# Altium project Telemetry.PrjPcb
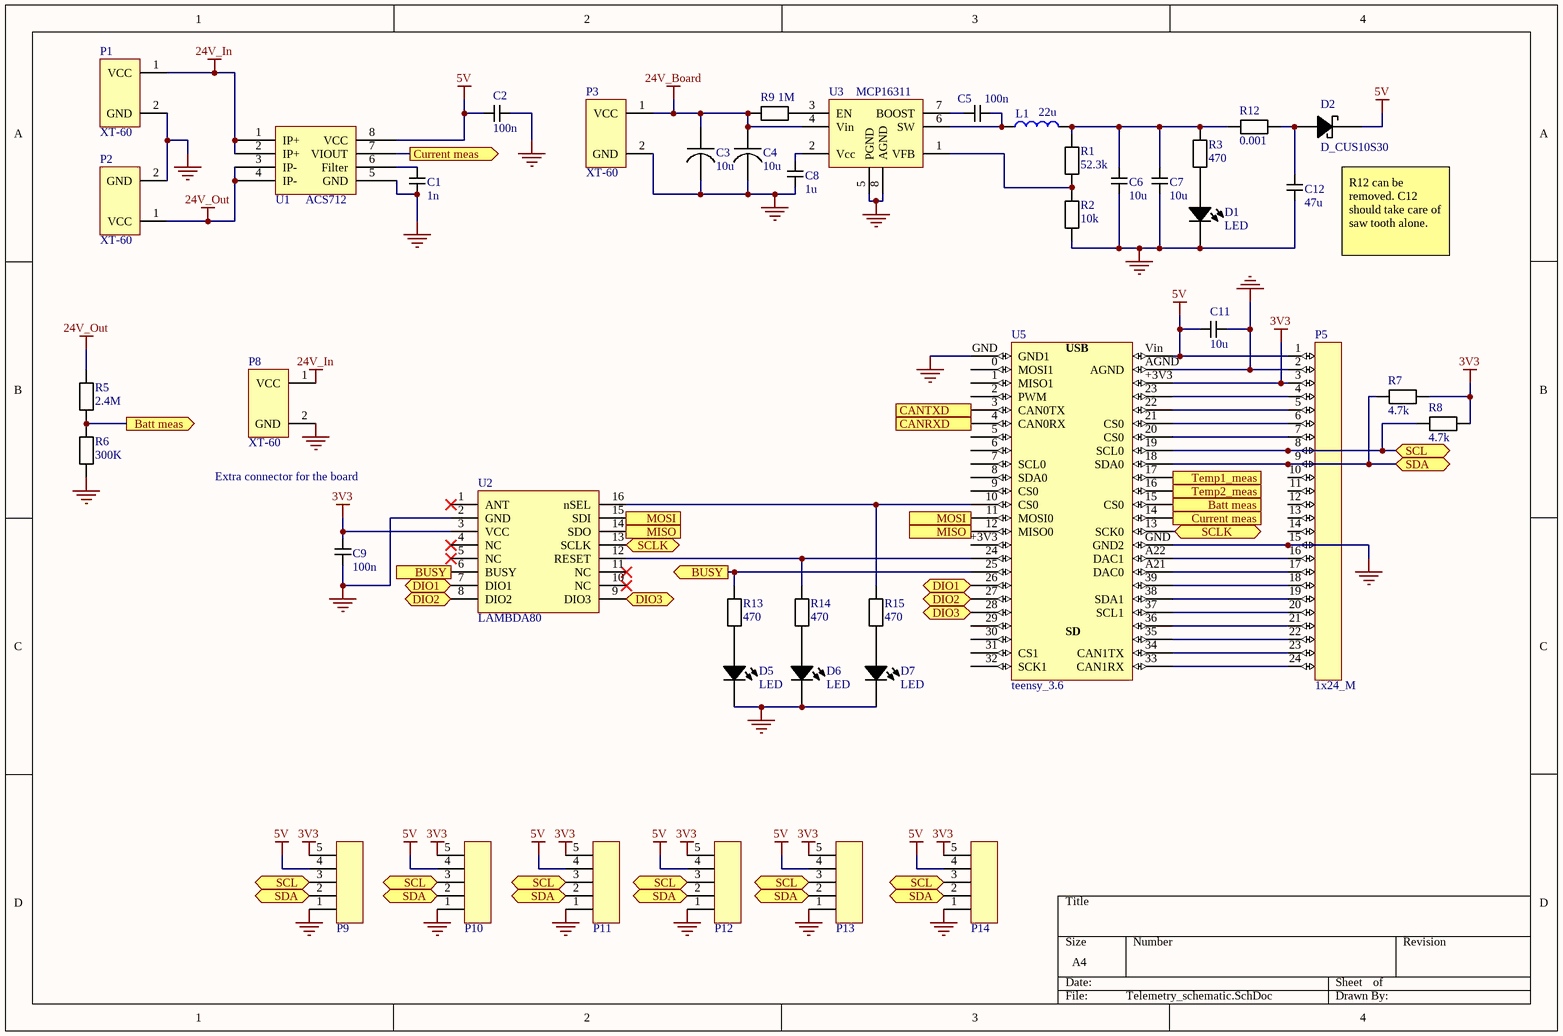
[diagram p0: Telemetry_schematic.SchDoc]
3 sheets, 71 parts. Net scope: flat (ports and power ports of the same name join across sheets).
Board file: Telemetry_PCB.PcbDoc
Sheets:
  Telemetry_schematic.SchDoc
  Telemetry_canbus.SchDoc
  Telemetry_temp_meas.SchDoc

## Sheet Telemetry_schematic.SchDoc: oiaejrboidr
size A4; Revision: 1.1; SheetNumber: 1; SheetTotal: 1

### Parts
C1  value 1n  [C_SMD_0805_pcb]  (hidden comment: SMD)
C2  value 100n  [C_SMD_0805_pcb]  (hidden comment: SMD)
C3  value 10u  [C_EL_SMT_Ø6.3]  (hidden comment: C_EL_SMT_Ø6.3)
C4  value 10u  [C_EL_SMT_Ø6.3]  (hidden comment: C_EL_SMT_Ø6.3)
C5  value 100n  [C_SMD_0805_pcb]  (hidden comment: SMD)
C6  value 10u  [C_SMD_0805_pcb]  (hidden comment: SMD)
C7  value 10u  [C_SMD_0805_pcb]  (hidden comment: SMD)
C8  value 1u  [C_SMD_0805_pcb]  (hidden comment: SMD)
C9  value 100n  [C_SMD_0805_pcb]  (hidden comment: SMD)
C11  value 10u  [C_SMD_0805_pcb]  (hidden comment: SMD)
C12  value 47u  [C_SMD_0805_pcb]  (hidden comment: SMD)
D1  LED  [D_LED_0805]
D2  D_CUS10S30  [D_SC-76]
D5  LED  [D_LED_0805]
D6  LED  [D_LED_0805]
D7  LED  [D_LED_0805]
L1  value 22u  [L_DR73_SMD]  (hidden comment: SMD)
P1  XT-60  [XT-60]
P2  XT-60  [XT-60]
P3  XT-60  [XT-60]
P5  1x24_M  [PIN_HEADER_M_1x24]
P8  XT-60  [XT-60]
P9  1x5_M  [PIN_HEADER_M_1x5]  (value not drawn)
P10  1x5_M  [PIN_HEADER_M_1x5]  (value not drawn)
P11  1x5_M  [PIN_HEADER_M_1x5]  (value not drawn)
P12  1x5_M  [PIN_HEADER_M_1x5]  (value not drawn)
P13  1x5_M  [PIN_HEADER_M_1x5]  (value not drawn)
P14  1x5_M  [PIN_HEADER_M_1x5]  (value not drawn)
R1  value 52.3k  [R_SMD_0805_pcb]  (hidden comment: SMD)
R2  value 10k  [R_SMD_0805_pcb]  (hidden comment: SMD)
R3  value 470  [R_SMD_0805_pcb]  (hidden comment: SMD)
R5  value 2.4M  [R_SMD_0805_pcb]  (hidden comment: SMD)
R6  value 300K  [R_SMD_0805_pcb]  (hidden comment: SMD)
R7  value 4.7k  [R_SMD_0805_pcb]  (hidden comment: SMD)
R8  value 4.7k  [R_SMD_0805_pcb]  (hidden comment: SMD)
R9  value 1M  [R_SMD_0805_pcb]  (hidden comment: SMD)
R12  value 0.001  [R_SMD_0805_pcb]  (hidden comment: SMD)
R13  value 470  [R_SMD_0805_pcb]  (hidden comment: SMD)
R14  value 470  [R_SMD_0805_pcb]  (hidden comment: SMD)
R15  value 470  [R_SMD_0805_pcb]  (hidden comment: SMD)
U1  ACS712  [ACS712_SMD]
U2  LAMBDA80  [LAMBDA62_SMT]
U3  MCP16311  [MCP16311/2_MSOP]
U5  teensy_3.6  [teensy_3.6]

### Ports
Batt meas (in), Batt meas (out), BUSY (in), BUSY (out), CANRXD (out), CANTXD (in), Current meas (in), Current meas (out), DIO1 (bidir), DIO2 (bidir), DIO3 (bidir), MISO (in), MISO (out), MOSI (in), MOSI (out), SCL (bidir), SCLK (bidir), SDA (bidir), Temp1_meas (in), Temp2_meas (in)

### Nets
3V3: C9.1 P5.3 P9.5 P10.5 P11.5 P12.5 P13.5 P14.5 R7.1 R8.1 U2.3(VCC) U5.+3V3
5V: C2.1 C11.2 D2.2 P5.1 P9.4 P10.4 P11.4 P12.4 P13.4 P14.4 U1.8(VCC) U5.Vin
24V_Board: C3.2 C4.2 P3.1(VCC) R9.1 U3.4(Vin)
24V_In: P1.1(VCC) P8.1(VCC) U1.1(IP+) U1.2(IP+)
24V_Out: P2.1(VCC) R5.2 U1.3(IP-) U1.4(IP-)
GND: C1.2 C2.2 C3.1 C4.1 C6.2 C7.2 C8.2 C9.2 C11.1 C12.2 D1.2 D5.2 D6.2 D7.2 P1.2(GND) P2.2(GND) P3.2(GND) P5.2 P5.15 P8.2(GND) P9.1 P10.1 P11.1 P12.1 P13.1 P14.1 R2.1 R6.1 U1.5(GND) U2.2(GND) U3.5(PGND) U3.8(AGND) U5.AGND U5.GND(GND1)
NetC1_1: C1.1 U1.6(Filter)
NetC5_1: C5.1 U3.7(BOOST)
NetC5_2: C5.2 L1.2 U3.6(SW)
NetC6_1: C6.1 C7.1 L1.1 R1.2 R3.2 R12.1
NetC8_1: C8.1 U3.2(Vcc)
NetC12_1: C12.1 D2.1 R12.2
NetC15_1: U5.17 ; port Temp1_meas
NetC18_1: U5.16 ; port Temp2_meas
NetD1_1: D1.1 R3.1
NetD5_1: D5.1 R13.1
NetD6_1: D6.1 R14.1
NetD7_1: D7.1 R15.1
NetP5_4: P5.4 U5.23
NetP5_5: P5.5 U5.22
NetP5_6: P5.6 U5.21(CS0)
NetP5_7: P5.7 U5.20(CS0)
NetP5_8: P5.8 P9.3 P10.3 P11.3 P12.3 P13.3 P14.3 R8.2 U5.19(SCL0) ; port SCL
NetP5_9: P5.9 P9.2 P10.2 P11.2 P12.2 P13.2 P14.2 R7.2 U5.18(SDA0) ; port SDA
NetP5_16: P5.16 U5.A22(DAC1)
NetP5_17: P5.17 U5.A21(DAC0)
NetP5_18: P5.18 U5.39
NetP5_19: P5.19 U5.38(SDA1)
NetP5_20: P5.20 U5.37(SCL1)
NetP5_21: P5.21 U5.36
NetP5_22: P5.22 U5.35
NetP5_23: P5.23 U5.34(CAN1TX)
NetP5_24: P5.24 U5.33(CAN1RX)
NetR1_1: R1.1 R2.2 U3.1(VFB)
NetR5_1: R5.1 R6.2 U5.15(CS0) ; port Batt meas
NetR9_2: R9.2 U3.3(EN)
NetR10_1: U5.4(CAN0RX) ; port CANRXD
NetR11_1: U5.3(CAN0TX) ; port CANTXD
NetR13_2: R13.2 U2.6(BUSY) U5.25 ; port BUSY
NetR14_2: R14.2 U2.12(RESET) U5.24
NetR15_2: R15.2 U2.16(nSEL) U5.10(CS0)
NetU1_7: U1.7(VIOUT) U5.14 ; port Current meas
NetU2_7: U2.7(DIO1) U5.26 ; port DIO1
NetU2_8: U2.8(DIO2) U5.27 ; port DIO2
NetU2_9: U2.9(DIO3) U5.28 ; port DIO3
NetU2_13: U2.13(SCLK) U5.13(SCK0) ; port SCLK
NetU2_14: U2.14(SDO) U5.12(MISO0) ; port MISO
NetU2_15: U2.15(SDI) U5.11(MOSI0) ; port MOSI

Not connected (* = marked no-connect by the designer): P5 10 11 12 13 14; U2 1(ANT)* 4(NC)* 5(NC)* 10(NC)* 11(NC)*; U5 0(MOSI1) 1(MISO1) 2(PWM) 5 6 7(SCL0) 8(SDA0) 9(CS0) 29 30 31(CS1) 32(SCK1)

### Notes on the sheet
- R12 can be removed. C12 should take care of saw tooth alone.
- Extra connector for the board
- (in symbol teensy_3.6) USB; SD

### Library data of the parts
C1 C2 C5-C9 C11 C12 = C_SMD_0805: Supplier 1: *; Supplier Part Number 1: *
D1 D5-D7 = D_LED_0805_SMD
D2 = D_CUS10S30: Schottky diode, 30V reverse voltage. 220mV forward drop @1A; Supplier Part Number 1: CUS10S30H3FCT-ND; Supplier Link 1: https://www.digikey.no/product-detail/en/toshiba-semiconductor-and-storage/CUS10S30H3F/CUS10S30H3FCT-ND/5114377
L1 = L_DR73_SMD: Supplier 1: *; Supplier Part Number 1: *
P5 = PIN_HEADER_M_1x24: Supplier Part Number 1: *; Supplier 1: *
P9-P14 = PIN_HEADER_M_1x5: Supplier Part Number 1: *; Supplier 1: *
R1-R3 R5-R9 R12-R15 = R_SMD_0805: Supplier 1: *; Supplier Part Number 1: *
U1 = ACS712_SMD: Supplier 1: *; Supplier Part Number 1: *
U2 = LAMBDA_80_DIP
U3 = MCP16311/2_SMD: Supplier 1: *; Supplier Part Number 1: *
C3 C4 = C_EL_SMT_Ø6.3: Supplier 1: *; Supplier Part Number 1: *
P1-P3 P8 = XT-60: Supplier Part Number 1: *; Supplier 1: *
U5 = teensy_3.6: Supplier 1: *; Supplier Part Number 1: *

## Sheet Telemetry_canbus.SchDoc: Telemetry CANbus
size A4; Organization: Altium Limited; Address1: L3, 12a Rodborough Rd; Address2: Frenchs Forest; Address3: NSW; Address4: Australia 2086; SheetNumber: 2; SheetTotal: 2
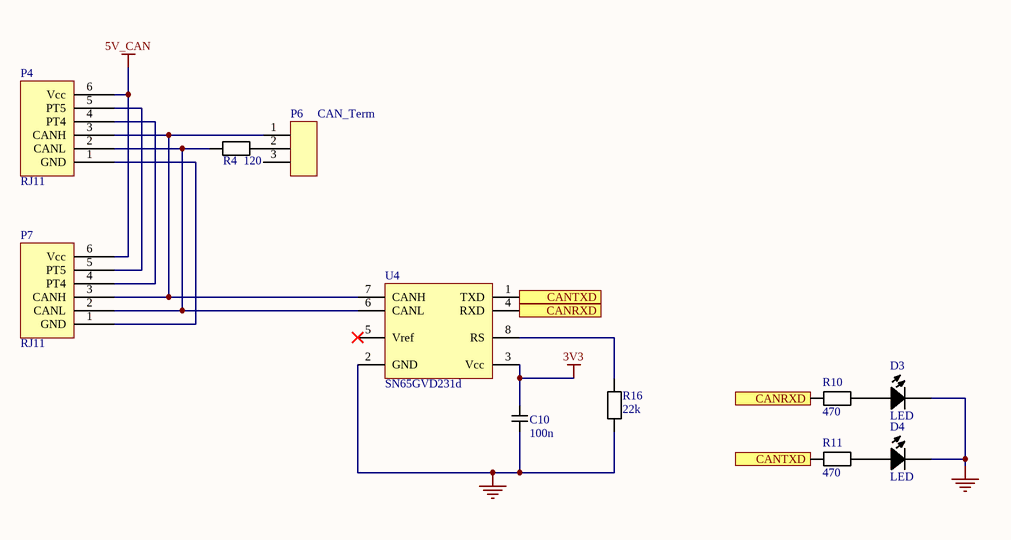
[diagram p1: Telemetry_canbus.SchDoc]

### Parts
C10  value 100n  [C_SMD_0805_pcb]  (hidden comment: SMD)
D3  LED  [D_LED_0805]
D4  LED  [D_LED_0805]
P4  RJ11  [RJ11_Connector]
P6  CAN_Term  [PIN_HEADER_M_1x3]
P7  RJ11  [RJ11_Connector]
R4  value 120  [R_SMD_0805_pcb]  (hidden comment: SMD)
R10  value 470  [R_SMD_0805_pcb]  (hidden comment: SMD)
R11  value 470  [R_SMD_0805_pcb]  (hidden comment: SMD)
R16  value 22k  [R_SMD_0805_pcb]  (hidden comment: SMD)
U4  SN65GVD231d  [SN65HVD231D_SMD]

### Ports
CANRXD, CANRXD (in), CANTXD, CANTXD (out)

### Nets
3V3: C10.1 U4.3(Vcc)
5V_CAN: P4.6(Vcc) P7.6(Vcc)
GND: C10.2 D3.2 D4.2 R16.1 U4.2(GND)
NetD3_1: D3.1 R10.2
NetD4_1: D4.1 R11.2
NetP4_1: P4.1(GND) P7.1(GND)
NetP4_2: P4.2(CANL) P7.2(CANL) R4.1 U4.6(CANL)
NetP4_3: P4.3(CANH) P6.1 P7.3(CANH) U4.7(CANH)
NetP4_4: P4.4(PT4) P7.4(PT4)
NetP4_5: P4.5(PT5) P7.5(PT5)
NetP6_2: P6.2 R4.2
NetR10_1: R10.1 U4.4(RXD) ; port CANRXD
NetR11_1: R11.1 U4.1(TXD) ; port CANTXD
NetR16_2: R16.2 U4.8(RS)

Not connected (* = marked no-connect by the designer): P6 3; U4 5(Vref)*

### Notes on the sheet
- Title
- Size:
- Date:
- A4
- Number:
- Time:
- Revision:
- Sheet
- of
- File:

### Library data of the parts
C10 = C_SMD_0805: Supplier 1: *; Supplier Part Number 1: *
D3 D4 = D_LED_0805_SMD
P4 P7 = RJ11_Connector: Supplier Part Number 1: *; Supplier 1: *
P6 = PIN_HEADER_M_1x3
R4 R10 R11 R16 = R_SMD_0805: Supplier 1: *; Supplier Part Number 1: *
U4 = SN65HVD231D_SMD: Supplier 1: *; Supplier Part Number 1: *

## Sheet Telemetry_temp_meas.SchDoc: Telemetry temp meas
size A4; Author: Magnus S. Aarnes; DrawnBy: Magnus Aarnes; Organization: Altium Limited; DocumentNumber: 1; Revision: 1; SheetNumber: 2; SheetTotal: 3
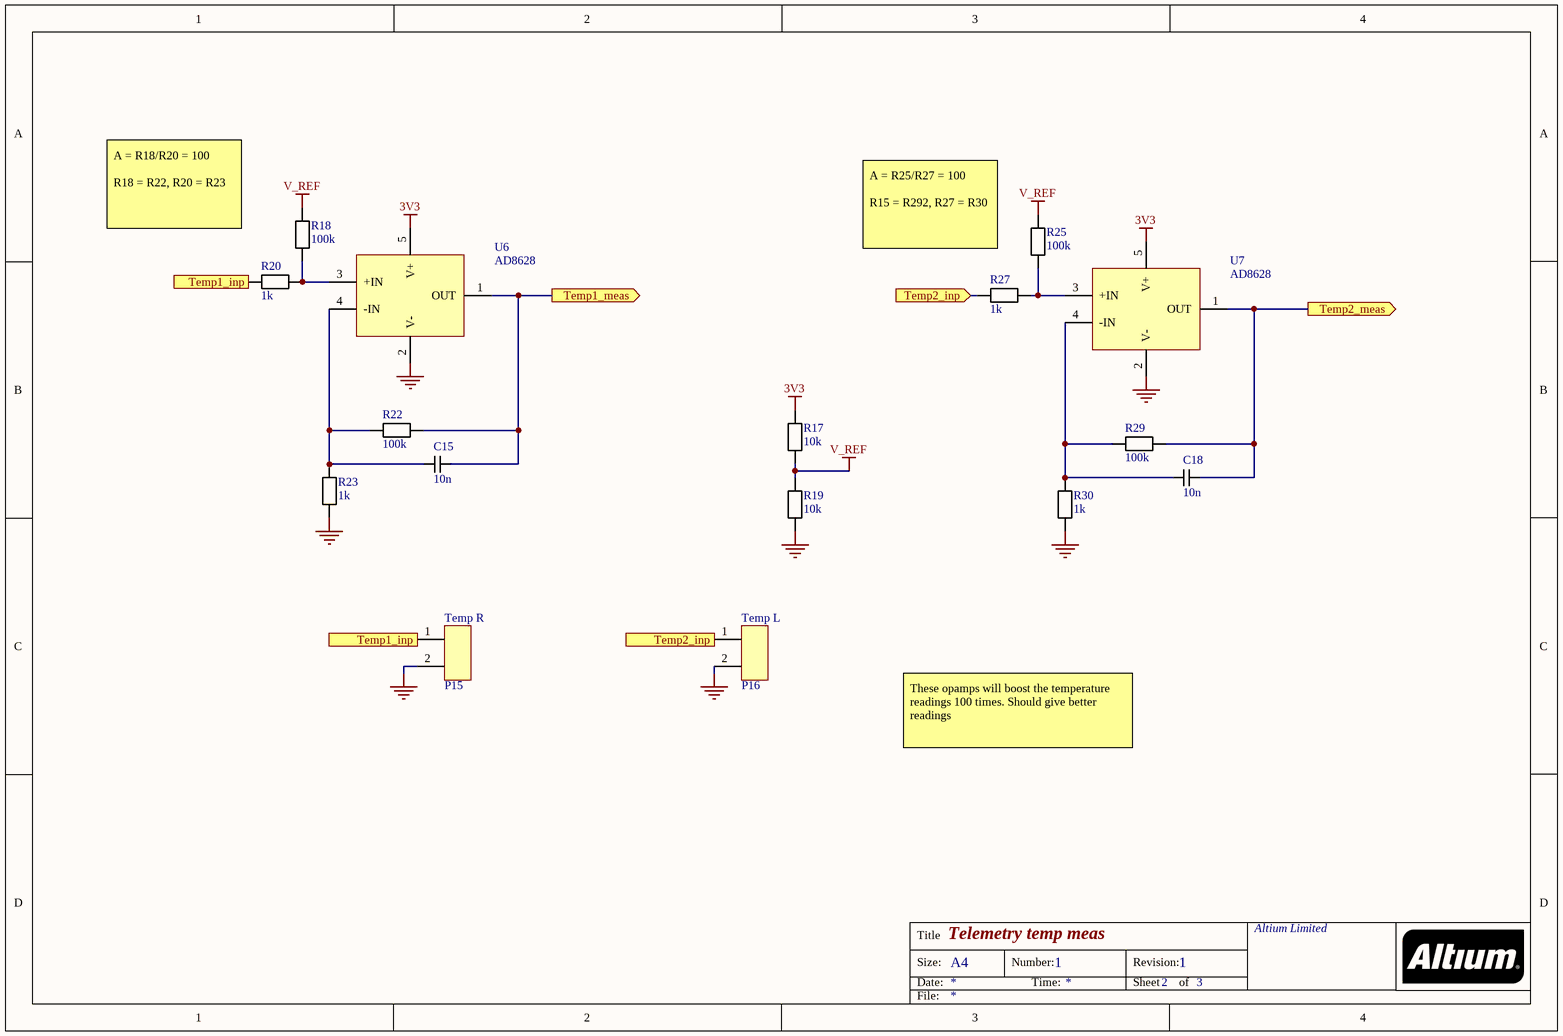
[diagram p2: Telemetry_temp_meas.SchDoc]

### Parts
C15  value 10n  [C_SMD_0805_pcb]  (hidden comment: SMD)
C18  value 10n  [C_SMD_0805_pcb]  (hidden comment: SMD)
P15  Temp R  [JST_SE_2PIN]
P16  Temp L  [JST_SE_2PIN]
R17  value 10k  [R_SMD_0805_pcb]  (hidden comment: SMD)
R18  value 100k  [R_SMD_0805_pcb]  (hidden comment: SMD)
R19  value 10k  [R_SMD_0805_pcb]  (hidden comment: SMD)
R20  value 1k  [R_SMD_0805_pcb]  (hidden comment: SMD)
R22  value 100k  [R_SMD_0805_pcb]  (hidden comment: SMD)
R23  value 1k  [R_SMD_0805_pcb]  (hidden comment: SMD)
R25  value 100k  [R_SMD_0805_pcb]  (hidden comment: SMD)
R27  value 1k  [R_SMD_0805_pcb]  (hidden comment: SMD)
R29  value 100k  [R_SMD_0805_pcb]  (hidden comment: SMD)
R30  value 1k  [R_SMD_0805_pcb]  (hidden comment: SMD)
U6  AD8628  [SOT-23-5]
U7  AD8628  [SOT-23-5]

### Ports
Temp1_inp (in), Temp1_inp (out), Temp1_meas (out), Temp2_inp (in), Temp2_inp (out), Temp2_meas (out)

### Nets
3V3: R17.2 U6.5(V+) U7.5(V+)
GND: P15.2 P16.2 R19.1 R23.1 R30.2 U6.2(V-) U7.2(V-)
V_REF: R17.1 R18.2 R19.2 R25.2
NetC15_1: C15.1 R22.2 U6.1(OUT) ; port Temp1_meas
NetC15_2: C15.2 R22.1 R23.2 U6.4(-IN)
NetC18_1: C18.1 R29.2 U7.1(OUT) ; port Temp2_meas
NetC18_2: C18.2 R29.1 R30.1 U7.4(-IN)
NetP15_1: P15.1 R20.1 ; port Temp1_inp
NetP16_1: P16.1 R27.1 ; port Temp2_inp
NetR18_1: R18.1 R20.2 U6.3(+IN)
NetR25_1: R25.1 R27.2 U7.3(+IN)

### Notes on the sheet
- A = R18/R20 = 100
  R18 = R22, R20 = R23
- A = R25/R27 = 100
  R15 = R292, R27 = R30
- These opamps will boost the temperature readings 100 times. Should give better readings
- Title
- Size:
- Date:
- A4
- Number:
- Time:
- Revision:
- Sheet
- of
- File:

### Library data of the parts
C15 C18 = C_SMD_0805: Supplier 1: *; Supplier Part Number 1: *
P15 P16 = JST_SE_2PIN: Supplier 1: *; Supplier Part Number 1: *
R17-R20 R22 R23 R25 R27 R29 R30 = R_SMD_0805: Supplier 1: *; Supplier Part Number 1: *
U6 U7 = AD8628WAUJZ-R7_SOT-23-5: Supplier Part Number 1: AD8628WAUJZ-R7CT-ND; Supplier Link 1: https://www.digikey.com/product-detail/en/analog-devices-inc/AD8628WAUJZ-R7/AD8628WAUJZ-R7CT-ND/2467896

## Nets that join several sheets
3V3: Telemetry_schematic (12 pins), Telemetry_canbus (C10.1 U4.3), Telemetry_temp_meas (R17.2 U6.5 U7.5)
GND: Telemetry_schematic (34 pins), Telemetry_canbus (5 pins), Telemetry_temp_meas (7 pins)
NetC15_1: Telemetry_schematic (U5.17), Telemetry_temp_meas (C15.1 R22.2 U6.1)
NetC18_1: Telemetry_schematic (U5.16), Telemetry_temp_meas (C18.1 R29.2 U7.1)
NetR10_1: Telemetry_schematic (U5.4), Telemetry_canbus (R10.1 U4.4)
NetR11_1: Telemetry_schematic (U5.3), Telemetry_canbus (R11.1 U4.1)